# Altium schematic sheet XL4015.SchDoc
size A4; SheetNumber: 2; SheetTotal: 2
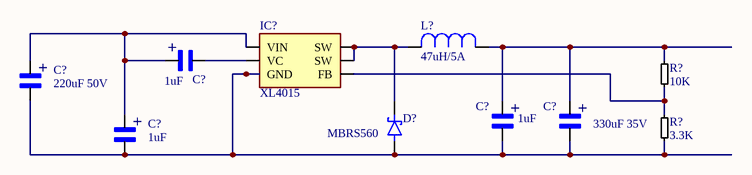
[diagram p0: XL4015.SchDoc]

## Parts
(Parts that share a designator on the sheet are numbered #1, #2 ... from top to bottom, then left to right.)
C?#1  1uF  [CAP CASE A]
C?#2  220uF 50V  [SMD CAP ALUM]
C?#3  1uF  [CAP CASE A]
C?#4  330uF 35V  [SMD CAP ALUM]
C?#5  1uF  [CAP CASE A]
D?  MBRS560  [DO214AB]
IC?  XL4015  [TO-263-5]
L?  47uH/5A  [CDRH147]
R?#1  10K  [0805 SMD RES]
R?#2  3.3K  [0805 SMD RES]

## Nets
NetC?#1_1: C?#1.1 C?#2.1 C?#5.1 IC?.5(VIN)
NetC?#1_2: C?#1.2 IC?.4(VC)
NetC?#2_2: C?#2.2 C?#3.2 C?#4.2 C?#5.2 D?.A IC?.1(GND) R?#2.1
NetC?#3_1: C?#3.1 C?#4.1 L?.1 R?#1.2
NetD?_C: D?.C(K) IC?.3(SW) IC?.6(SW) L?.2
NetIC?_2: IC?.2(FB) R?#1.1 R?#2.2

## Notes on the sheet
- (in symbol CAP Case A) +
- (in symbol CAP SMD ALUM) +

## Library data of the parts
C?#1 C?#3 C?#5 = CAP Case A
C?#2 C?#4 = CAP SMD ALUM
D? = DO214AB
L? = CDRH127 - SMD Bobin
R?#1 R?#2 = RES SMD 0805